# Altium schematic sheet E-Fuse.SchDoc
size A; SheetNumber: 1; SheetTotal: 2
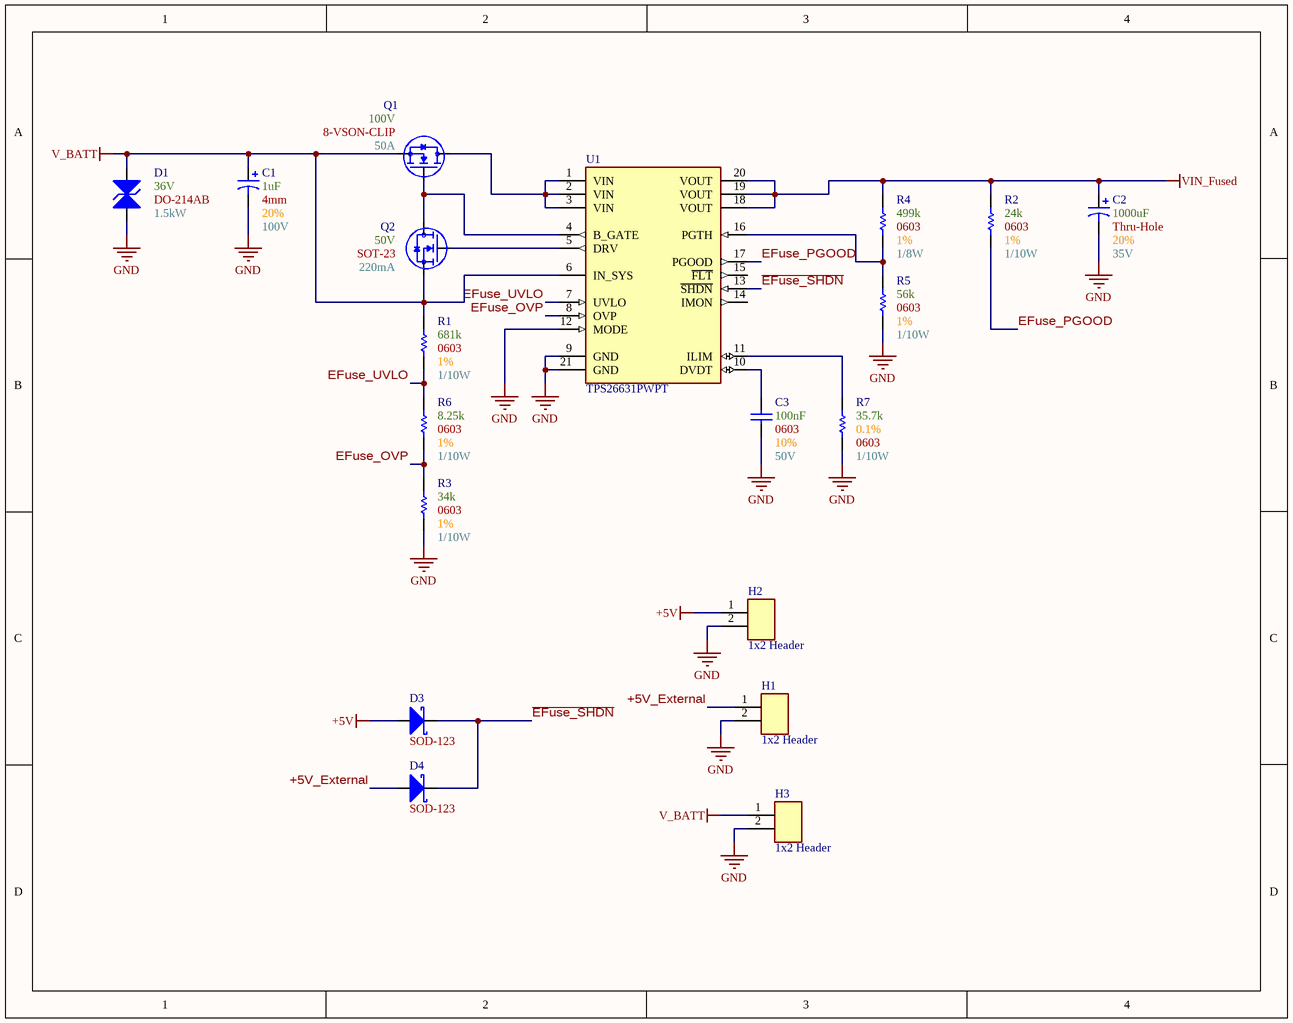
[diagram p0: E-Fuse.SchDoc]

## Parts
C1  Max Voltage: 100V  Size Package: 4mm  Tolerance: 20%  Capacitance: 1uF  [[Cap] SMD Polarized, 4mm]  (hidden comment: [Cap] 4mm 1uF 20% 100V)
C2  Max Voltage: 35V  Size Package: Thru-Hole  Tolerance: 20%  Capacitance: 1000uF  [[Cap] Thru-Hole Polarized 10mm]  (hidden comment: [Cap] Thru-Hole 1000uF 20% 35V)
C3  Max Voltage: 50V  Size Package: 0603  Tolerance: 10%  Capacitance: 100nF  [[Cap] SMD 0603]  (hidden comment: [Cap] 0603 0.1uF 10% 50V)
D1  Wattage: 1.5kW  Optimal Zener Voltage: 36V  [[Diode] SMD DO-214AB]  (hidden comment: DO-214AB)
D3  Footprint: SOD-123  [[Diode] SMD SOD-123]  (hidden comment: SOD123)
D4  Footprint: SOD-123  [[Diode] SMD SOD-123]  (hidden comment: SOD123)
H1  1x2 Header  [[Header] 1x2 Male]
H2  1x2 Header  [[Header] 1x2 Male]
H3  1x2 Header  [[Header] 1x2 Male]
Q1  IDS_Max: 50A  VDS_Max: 100V  [8-VSON-CLIP]  (hidden comment: CSD19537Q3)
Q2  IDS_Max: 220mA  VDS_Max: 50V  [SOT-23]  (hidden comment: [NMOS] SMD 50V 220mA 3mOhm)
R1  Wattage: 1/10W  Tolerance: 1%  Resistance: 681k  Size Package: 0603  [[Res] SMD 0603]  (hidden comment: [681k] SMD 0603 1% 1/10W)
R2  Wattage: 1/10W  Tolerance: 1%  Resistance: 24k  Size Package: 0603  [[Res] SMD 0603]  (hidden comment: [24k] SMD 0603 1% 1/10W)
R3  Wattage: 1/10W  Tolerance: 1%  Resistance: 34k  Size Package: 0603  [[Res] SMD 0603]  (hidden comment: [34k] SMD 0603 1% 1/10W)
R4  Wattage: 1/8W  Tolerance: 1%  Resistance: 499k  Size Package: 0603  [[Res] SMD 0603]  (hidden comment: [499k] SMD 0603 1% 1/8W)
R5  Wattage: 1/10W  Tolerance: 1%  Resistance: 56k  Size Package: 0603  [[Res] SMD 0603]  (hidden comment: [56k] SMD 0603 1% 1/10W)
R6  Wattage: 1/10W  Tolerance: 1%  Resistance: 8.25k  Size Package: 0603  [[Res] SMD 0603]  (hidden comment: [8.25k] SMD 0603 1% 1/10W)
R7  Wattage: 1/10W  Tolerance: 0.1%  Resistance: 35.7k  Size Package: 0603  [[Res] SMD 0603]  (hidden comment: [35.7k] SMD 0603 0.1% 1/10W)
U1  TPS26631PWPT  [[E-Fuse] 4.5-60V 6A]

## Nets
+5V: D3.2(A) H2.1
GND: C1.2 C2.2 C3.1 D1.2(A) H1.2 H2.2 H3.2 R3.1 R5.1 R7.1 U1.9(GND) U1.12(MODE) U1.21(GND)
V_BATT: C1.1 D1.1(K) H3.1 Q1.2(Source) Q2.2(Source) R1.2 U1.6(IN_SYS)
VIN_Fused: C2.1 R2.2 R4.2 U1.18(VOUT) U1.19(VOUT) U1.20(VOUT)
+5V_External: D4.2(A) H1.1
~{EFuse_SHDN}: D3.1(K) D4.1(K) U1.13(~{SHDN})
EFuse_OVP: R3.2 R6.1 U1.8(OVP)
EFuse_PGOOD: R2.1 U1.17(PGOOD)
EFuse_UVLO: R1.1 R6.2 U1.7(UVLO)
NetC3_2: C3.2 U1.10(DVDT)
NetQ1_1: Q1.1(Gate) Q2.3(Drain) U1.4(B_GATE)
NetQ1_3: Q1.3(Drain) U1.1(VIN) U1.2(VIN) U1.3(VIN)
NetQ2_1: Q2.1(Gate) U1.5(DRV)
NetR4_1: R4.1 R5.2 U1.16(PGTH)
NetR7_2: R7.2 U1.11(ILIM)

Not connected (* = marked no-connect by the designer): U1 14(IMON) 15(~{FLT})

## Library data of the parts
C1 = [Cap] 4mm 1uF 20% 100V: 865080840001; Supplier 1: DigiKey; Supplier Part Number 1: 732-865080840001CT-ND
C2 = [Cap] Thru-Hole 1000uF 20% 35V: 35PK1000MEFC10X20; Supplier 1: DigiKey; Supplier Part Number 1: 1189-1742-ND
C3 = [Cap] 0603 0.1uF 10% 50V: CL10B104KB8NNNC; Supplier 1: DigiKey; Supplier Part Number 1: 1276-1000-6-ND
D1 = [TVS] 36Vnom 40Vclamp_max: SMCJ36CA; Supplier 1: DigiKey; Supplier Part Number 1: SMCJ36CALFDKR-ND; Footprint: DO-214AB
D3 D4 = [Schottky] SMD 40V 1A: B5819W-TP; Supplier 1: DigiKey; Supplier Part Number 1: B5819W-TPMSCT-ND
H1-H3 = [Header] 1x2 Male: 2.54mm pitch
Q1 = [NMOS] SMD 100V 50A 14.5mOhm: Supplier 1: DigiKey; Supplier Part Number 1: 296-44351-6-ND; Package: 8-VSON-CLIP
Q2 = [NMOS] SMD 50V 220mA 3mOhm: BSS138; Supplier 1: DigiKey; Supplier Part Number 1: BSS138DKR-ND; Package: SOT-23
R1 = [681k] SMD 0603 1% 1/10W: RT0603FRE07681KL; Supplier 1: DigiKey; Supplier Part Number 1: 13-RT0603FRE07681KLCT-ND
R2 = [24k] SMD 0603 1% 1/10W: RC0603FR-1324KL; Supplier 1: DigiKey; Supplier Part Number 1: 13-RC0603FR-1324KLCT-ND
R3 = [34k] SMD 0603 1% 1/10W: RC0603FR-1334KL; Supplier 1: DigiKey; Supplier Part Number 1: 13-RC0603FR-1334KLDKR-ND
R4 = [499k] SMD 0603 1% 1/8W: CRCW0603499KFKEA; Supplier 1: DigiKey; Supplier Part Number 1: 541-499KHDKR-ND
R5 = [56k] SMD 0603 1% 1/10W: CRGCQ0603F56K; Supplier 1: DigiKey; Supplier Part Number 1: A129709CT-ND
R6 = [8.25k] SMD 0603 1% 1/10W: AF0603FR-078K25L; Supplier 1: DigiKey; Supplier Part Number 1: 13-AF0603FR-078K25LCT-ND
R7 = [35.7k] SMD 0603 0.1% 1/10W: RT0603BRE0735K7L; Supplier 1: DigiKey; Supplier Part Number 1: YAG4707CT-ND
U1 = [E-Fuse] 4.5-60V 6A